# Altium project PCM1794.PrjPcb
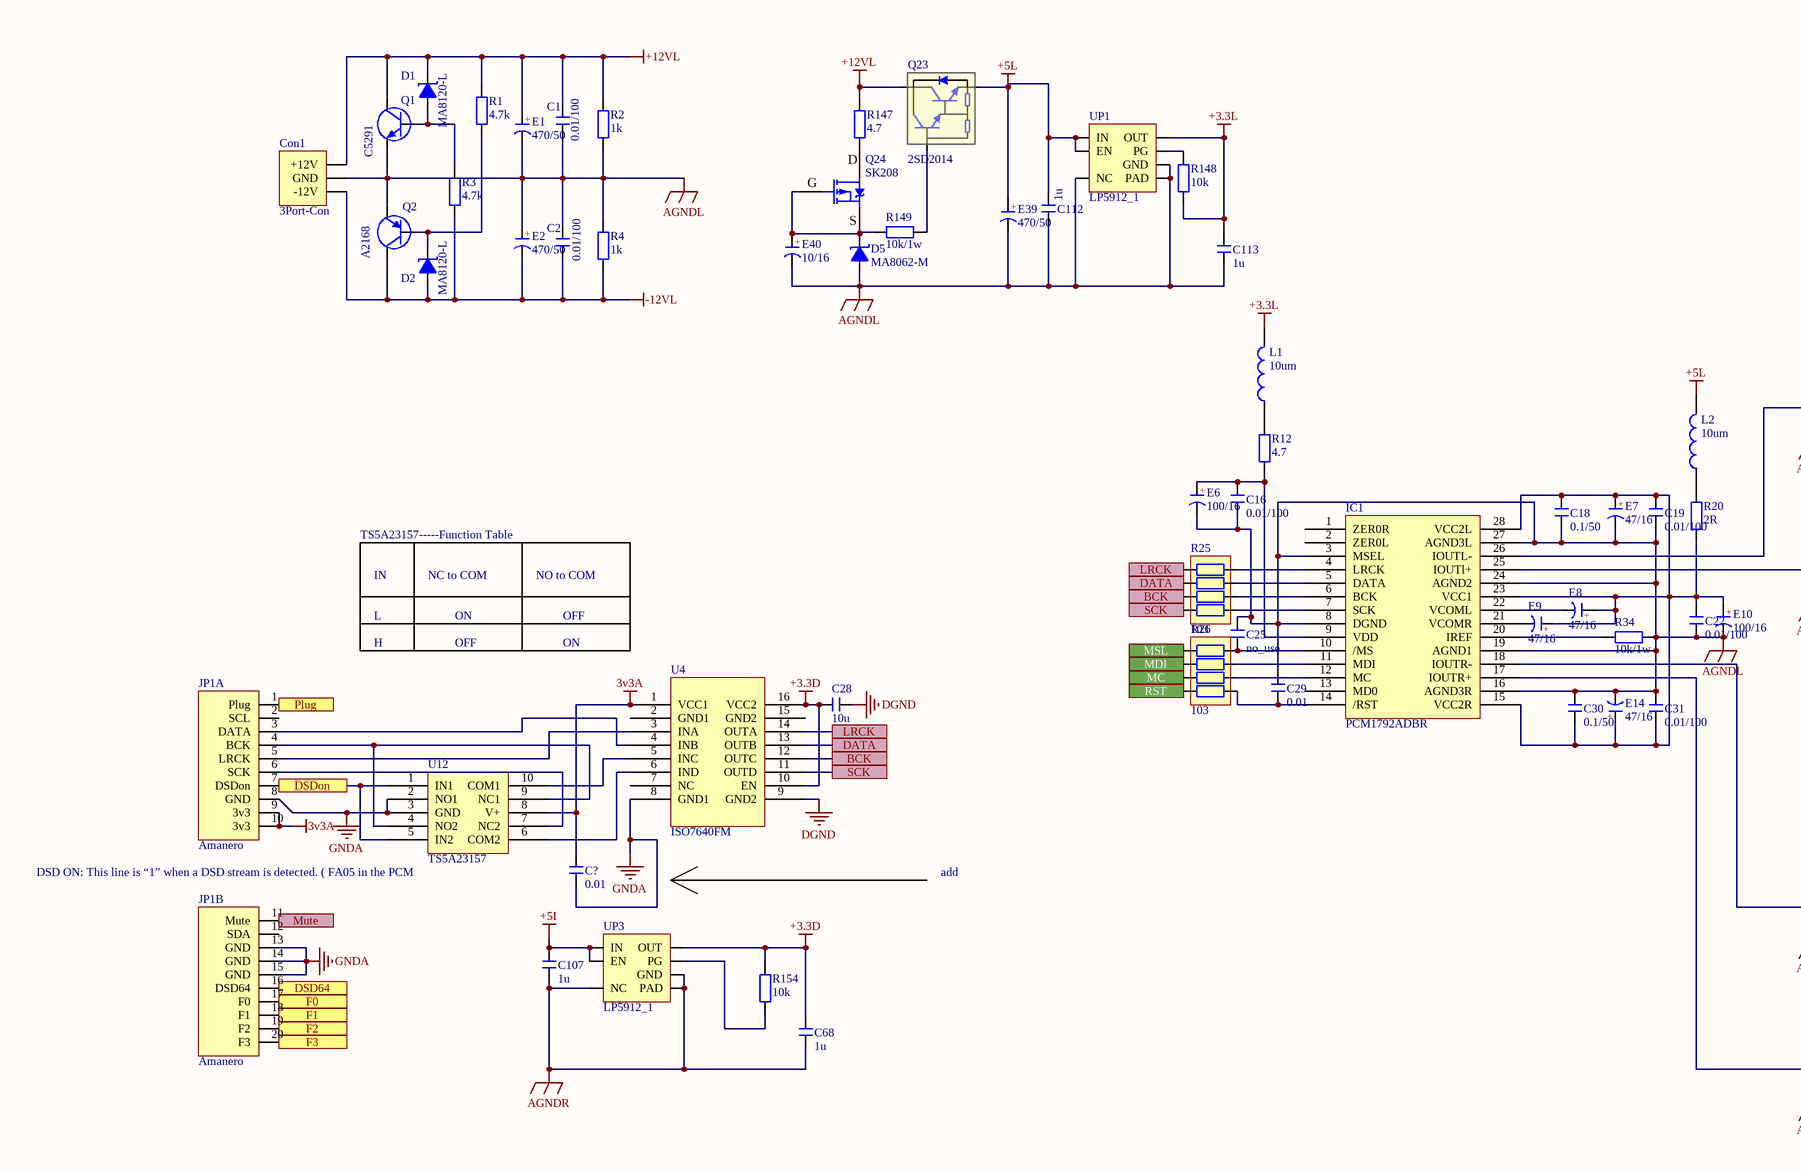
[diagram p0: Audio.SchDoc, top left]
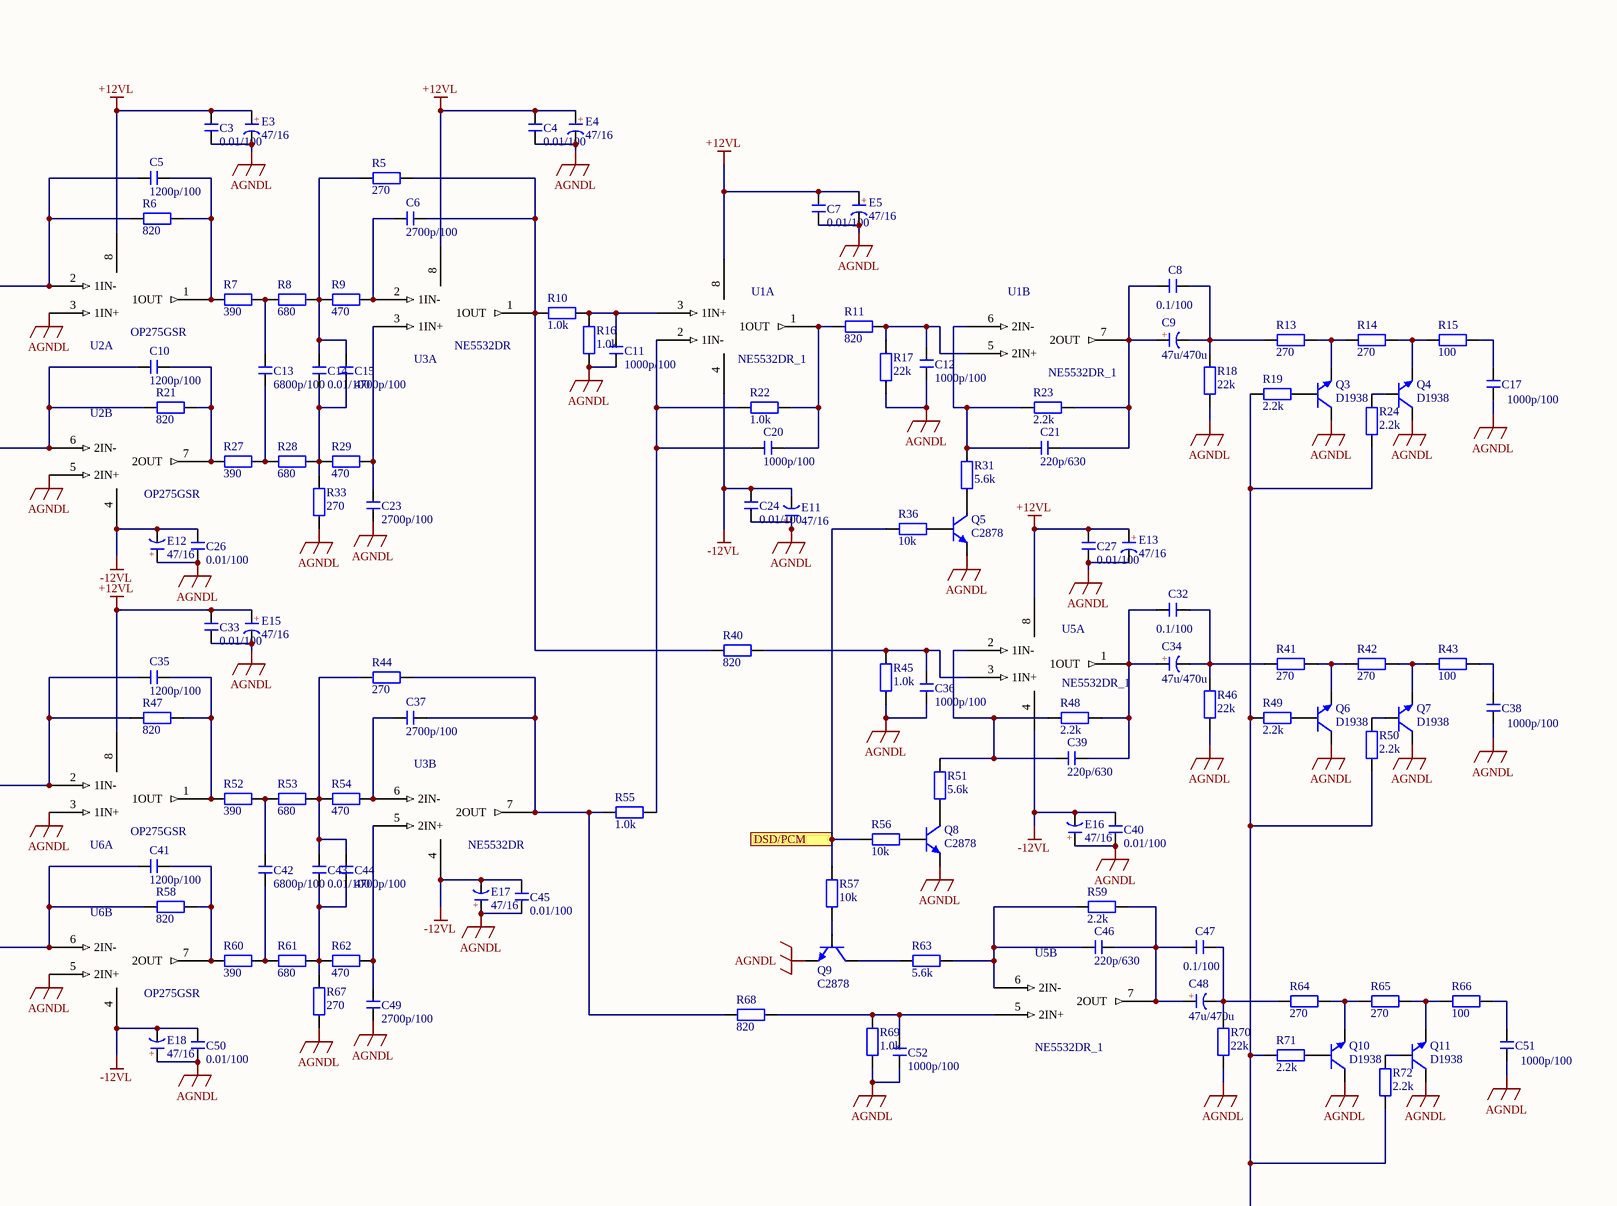
[diagram p1: Audio.SchDoc, top right]
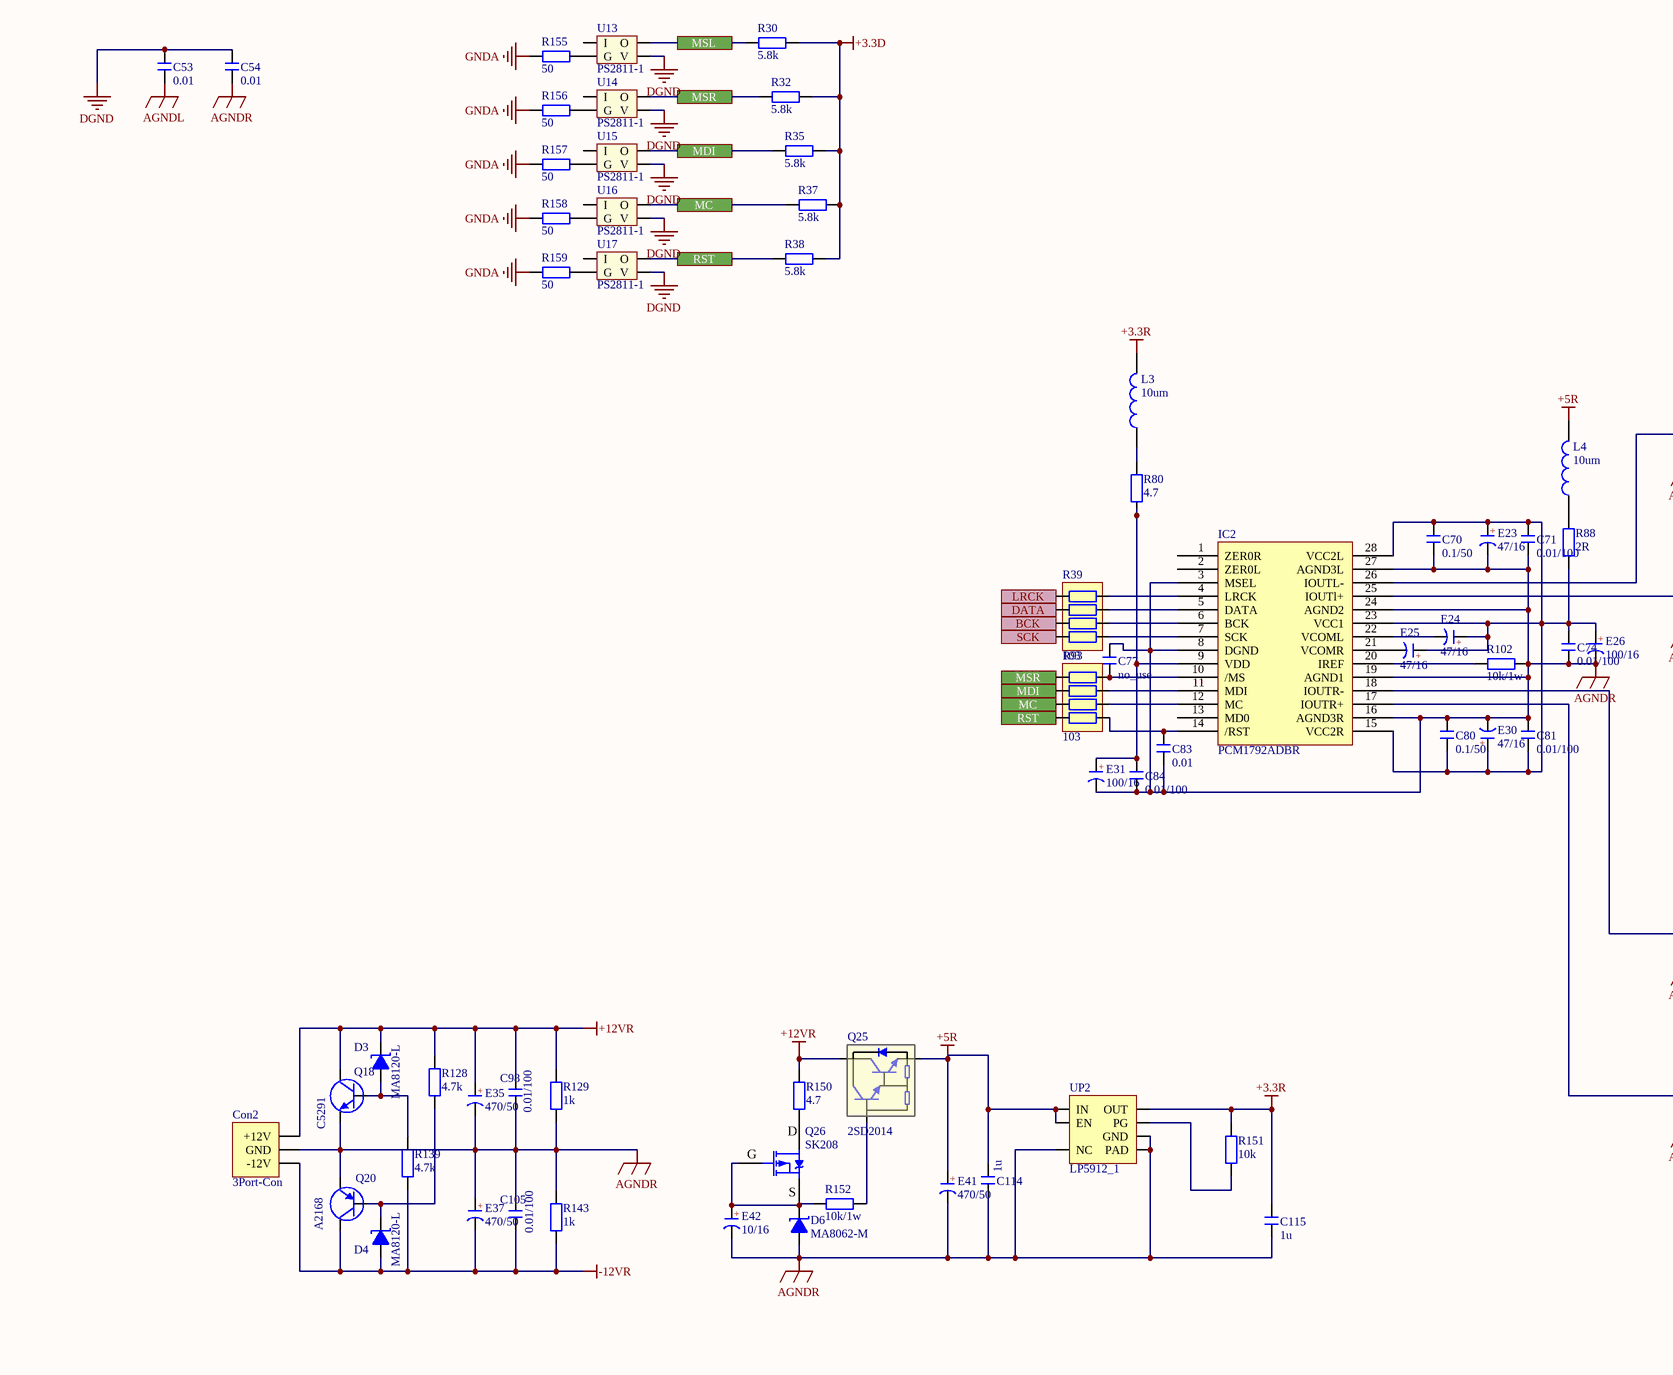
[diagram p2: Audio.SchDoc, bottom left]
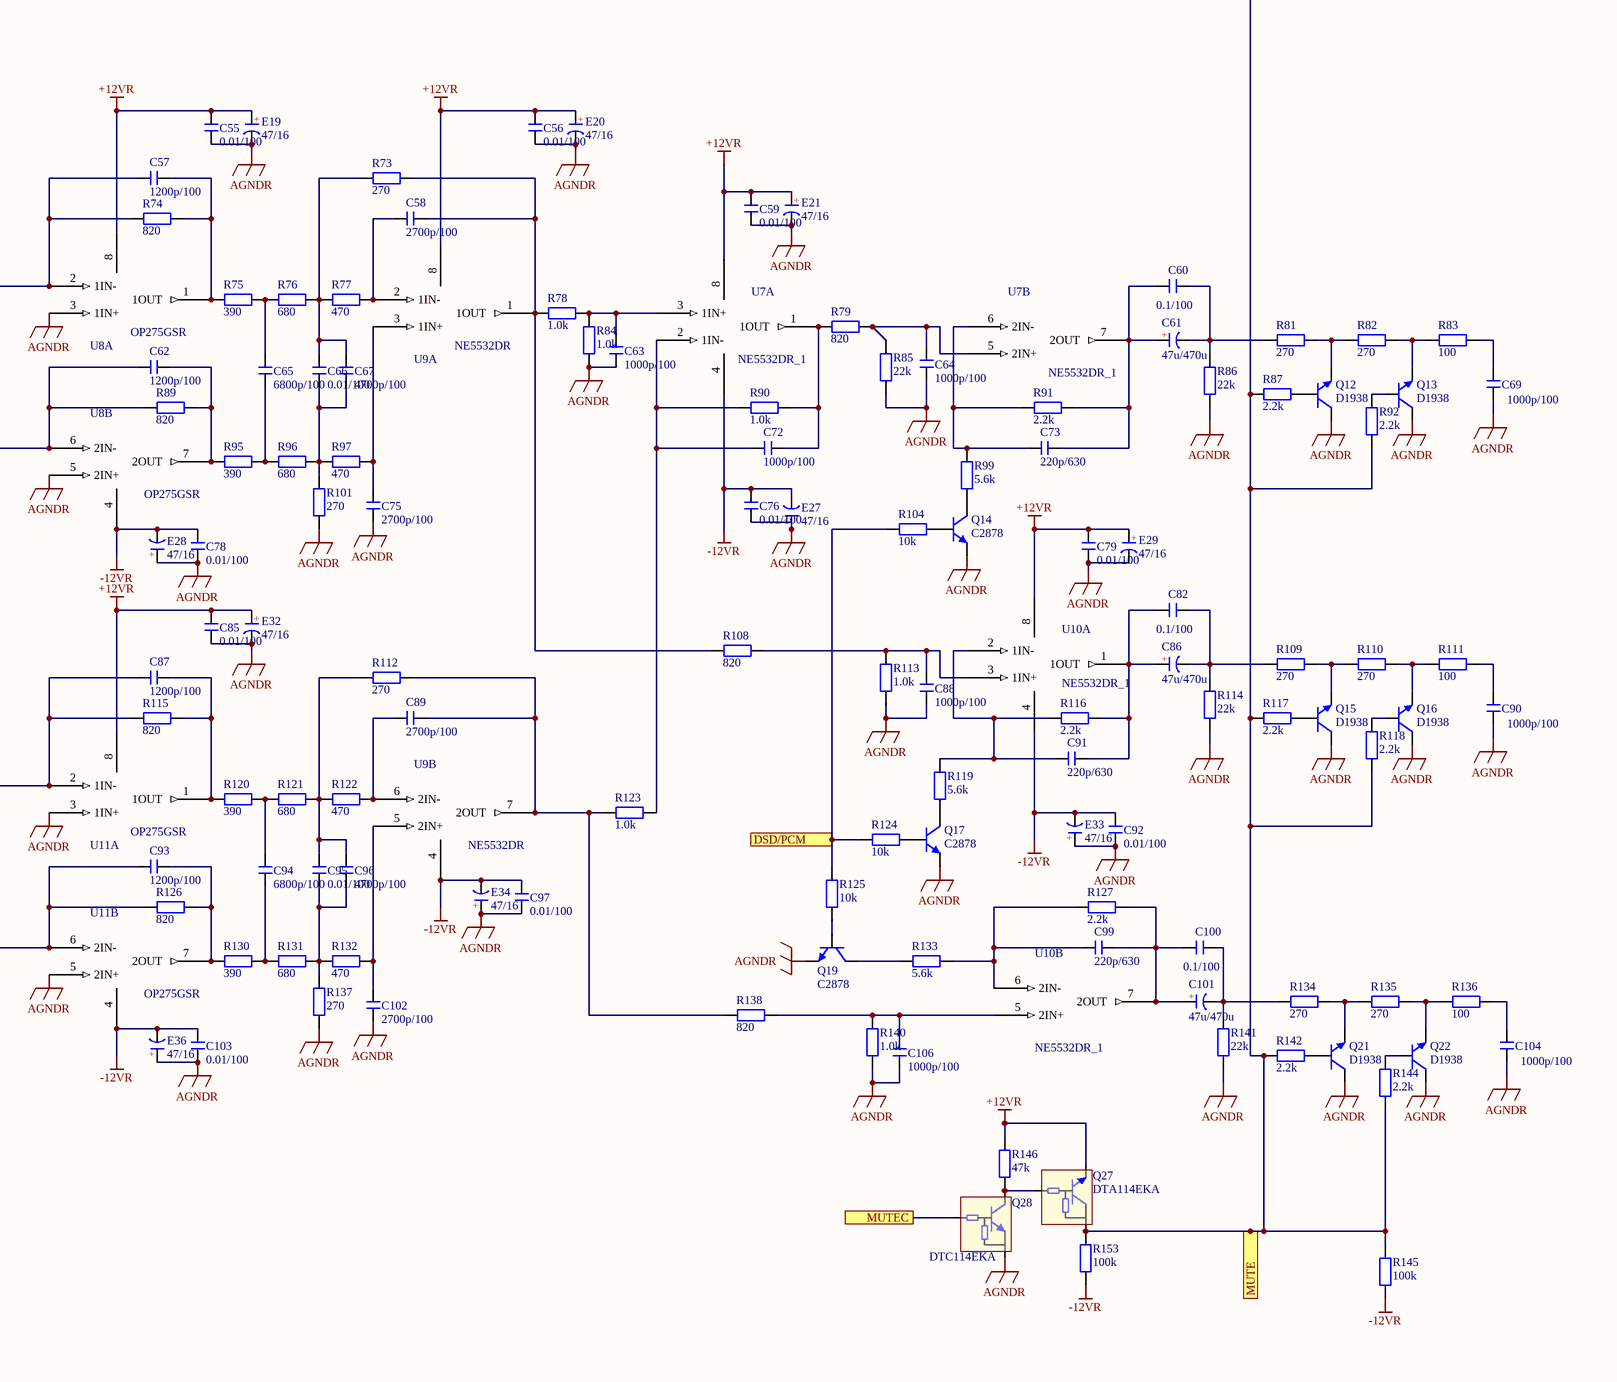
[diagram p3: Audio.SchDoc, bottom right]
1 sheet, 367 parts. Net scope: flat (ports and power ports of the same name join across sheets).
Board file: PCB_Audio.PcbDoc

## Sheet Audio.SchDoc
size A1

### Parts
C1  0.01/100  [CCB_Cap_5mm]
C2  0.01/100  [CCB_Cap_5mm]
C3  0.01/100
C4  0.01/100
C5  1200p/100
C6  2700p/100
C7  0.01/100
C8  0.1/100
C9  47u/470u
C10  1200p/100
C11  1000p/100
C12  1000p/100
C13  6800p/100
C14  0.01/100
C15  4700p/100
C16  0.01/100  [CCB_Cap_5mm_MIR]
C17  1000p/100
C18  0.1/50  [C0805]
C19  0.01/100
C20  1000p/100
C21  220p/630
C22  0.01/100
C23  2700p/100
C24  0.01/100
C25  no_use
C26  0.01/100
C27  0.01/100
C28  10u  [C0805]
C29  0.01  [C0805]
C30  0.1/50  [C0805]
C31  0.01/100
C32  0.1/100
C33  0.01/100
C34  47u/470u
C35  1200p/100
C36  1000p/100
C37  2700p/100
C38  1000p/100
C39  220p/630
C40  0.01/100
C41  1200p/100
C42  6800p/100
C43  0.01/100
C44  4700p/100
C45  0.01/100
C46  220p/630
C47  0.1/100
C48  47u/470u
C49  2700p/100
C50  0.01/100
C51  1000p/100
C52  1000p/100
C53  0.01  [C0805]
C54  0.01  [C0805]
C55  0.01/100
C56  0.01/100
C57  1200p/100
C58  2700p/100
C59  0.01/100
C60  0.1/100
C61  47u/470u
C62  1200p/100
C63  1000p/100
C64  1000p/100
C65  6800p/100
C66  0.01/100
C67  4700p/100
C68  1u  [C0805]
C69  1000p/100
C70  0.1/50  [C0805]
C71  0.01/100
C72  1000p/100
C73  220p/630
C74  0.01/100
C75  2700p/100
C76  0.01/100
C77  no_use
C78  0.01/100
C79  0.01/100
C80  0.1/50  [C0805]
C81  0.01/100
C82  0.1/100
C83  0.01  [C0805]
C84  0.01/100  [CCB_Cap_5mm]
C85  0.01/100
C86  47u/470u
C87  1200p/100
C88  1000p/100
C89  2700p/100
C90  1000p/100
C91  220p/630
C92  0.01/100
C93  1200p/100
C94  6800p/100
C95  0.01/100
C96  4700p/100
C97  0.01/100
C98  0.01/100  [CCB_Cap_5mm]
C99  220p/630
C100  0.1/100
C101  47u/470u
C102  2700p/100
C103  0.01/100
C104  1000p/100
C105  0.01/100  [CCB_Cap_5mm]
C106  1000p/100
C107  1u  [C0805]
C112  1u  [CCB_Cap_5mm_MIR]
C113  1u  [C0805]
C114  1u  [CCB_Cap_5mm_MIR]
C115  1u  [C0805]
C?  0.01  [C0805]
Con1  3Port-Con  [XH2.54-3P]
Con2  3Port-Con  [XH2.54-3P]
D1  MA8120-L  [SOD-323]
D2  MA8120-L  [SOD-323]
D3  MA8120-L  [SOD-323]
D4  MA8120-L  [SOD-323]
D5  MA8062-M  [SOD-323]
D6  MA8062-M  [SOD-323]
E1  470/50  [Cap-P]
E2  470/50  [Cap-P]
E3  47/16
E4  47/16
E5  47/16
E6  100/16  [cap-mir]
E7  47/16
E8  47/16
E9  47/16
E10  100/16
E11  47/16
E12  47/16
E13  47/16
E14  47/16
E15  47/16
E16  47/16
E17  47/16
E18  47/16
E19  47/16
E20  47/16
E21  47/16
E23  47/16
E24  47/16
E25  47/16
E26  100/16
E27  47/16
E28  47/16
E29  47/16
E30  47/16
E31  100/16  [cap]
E32  47/16
E33  47/16
E34  47/16
E35  470/50  [Cap-P]
E36  47/16
E37  470/50  [Cap-P]
E39  470/50  [Cap-P]
E40  10/16  [cap-mir]
E41  470/50  [Cap-P]
E42  10/16  [cap-mir]
IC1  PCM1792ADBR  [DB0028A_N]
IC2  PCM1792ADBR  [DB0028A_N]
JP1  Amanero  [HDR-9X2]  (parts A,B of 2)
L1  10um  [L 0805]
L2  10um  [L 0805]
L3  10um  [L 0805]
L4  10um  [L 0805]
Q1  C5291
Q2  A2168
Q3  D1938  [SOT23-3L]
Q4  D1938  [SOT23-3L]
Q5  C2878
Q6  D1938  [SOT23-3L]
Q7  D1938  [SOT23-3L]
Q8  C2878
Q9  C2878
Q10  D1938  [SOT23-3L]
Q11  D1938  [SOT23-3L]
Q12  D1938  [SOT23-3L]
Q13  D1938  [SOT23-3L]
Q14  C2878
Q15  D1938  [SOT23-3L]
Q16  D1938  [SOT23-3L]
Q17  C2878
Q18  C5291
Q19  C2878
Q20  A2168
Q21  D1938  [SOT23-3L]
Q22  D1938  [SOT23-3L]
Q23  2SD2014
Q24  SK208  [SOT23-3L]
Q25  2SD2014
Q26  SK208  [SOT23-3L]
Q27  DTA114EKA  [SOT23-3L]
Q28  DTC114EKA  [SOT23-3L]
R1  4.7k  [R 0805]
R2  1k  [Res_axial-Mir]
R3  4.7k  [R 0805]
R4  1k  [Res_axial-Mir]
R5  270
R6  820
R7  390
R8  680
R9  470
R10  1.0k
R11  820
R12  4.7
R13  270
R14  270
R15  100
R16  1.0k
R17  22k
R18  22k
R19  2.2k  [R 0805]
R20  2R
R21  820
R22  1.0k
R23  2.2k
R24  2.2k  [R 0805]
R25  103  [RCA-8P4R-0603]
R26  103  [RCA-8P4R-0603]
R27  390
R28  680
R29  470
R30  5.8k  [R 0805]
R31  5.6k
R32  5.8k  [R 0805]
R33  270
R34  10k/1w
R35  5.8k  [R 0805]
R36  10k  [R 0805]
R37  5.8k  [R 0805]
R38  5.8k  [R 0805]
R39  103  [RCA-8P4R-0603]
R40  820
R41  270
R42  270
R43  100
R44  270
R45  1.0k
R46  22k
R47  820
R48  2.2k
R49  2.2k  [R 0805]
R50  2.2k  [R 0805]
R51  5.6k
R52  390
R53  680
R54  470
R55  1.0k
R56  10k  [R 0805]
R57  10k  [R 0805]
R58  820
R59  2.2k
R60  390
R61  680
R62  470
R63  5.6k
R64  270
R65  270
R66  100
R67  270
R68  820
R69  1.0k
R70  22k
R71  2.2k  [R 0805]
R72  2.2k  [R 0805]
R73  270
R74  820
R75  390
R76  680
R77  470
R78  1.0k
R79  820
R80  4.7
R81  270
R82  270
R83  100
R84  1.0k
R85  22k
R86  22k
R87  2.2k  [R 0805]
R88  2R
R89  820
R90  1.0k
R91  2.2k
R92  2.2k  [R 0805]
R93  103  [RCA-8P4R-0603]
R95  390
R96  680
R97  470
R99  5.6k
R101  270
R102  10k/1w
R104  10k  [R 0805]
R108  820
R109  270
R110  270
R111  100
R112  270
R113  1.0k
R114  22k
R115  820
R116  2.2k
R117  2.2k  [R 0805]
R118  2.2k  [R 0805]
R119  5.6k
R120  390
R121  680
R122  470
R123  1.0k
R124  10k  [R 0805]
R125  10k  [R 0805]
R126  820
R127  2.2k
R128  4.7k  [R 0805]
R129  1k  [Res_axial-Mir]
R130  390
R131  680
R132  470
R133  5.6k
R134  270
R135  270
R136  100
R137  270
R138  820
R139  4.7k  [R 0805]
R140  1.0k
R141  22k
R142  2.2k  [R 0805]
R143  1k  [Res_axial-Mir]
R144  2.2k  [R 0805]
R145  100k
R146  47k  [R 0805]
R147  4.7  [Res_axial-Mir]
R148  10k  [R 0805]
R149  10k/1w  [Res_axial-Mir]
R150  4.7  [Res_axial-Mir]
R151  10k  [R 0805]
R152  10k/1w  [Res_axial-Mir]
R153  100k  [R 0805]
R154  10k  [R 0805]
R155  50  [R 0603]
R156  50  [R 0603]
R157  50  [R 0603]
R158  50  [R 0603]
R159  50  [R 0603]
U1  NE5532DR_1  [D8]  (parts A,B of 2)
U2  OP275GSR  [D8]  (parts A,B of 2)
U3  NE5532DR  [D8]  (parts A,B of 2)
U4  ISO7640FM  [SOIC16]
U5  NE5532DR_1  [D8]  (parts A,B of 2)
U6  OP275GSR  [D8]  (parts A,B of 2)
U7  NE5532DR_1  [D8]  (parts A,B of 2)
U8  OP275GSR  [D8]  (parts A,B of 2)
U9  NE5532DR  [D8]  (parts A,B of 2)
U10  NE5532DR_1  [D8]  (parts A,B of 2)
U11  OP275GSR  [D8]  (parts A,B of 2)
U12  TS5A23157  [DGS-10]
U13  PS2811-1  [SSOP4_N]
U14  PS2811-1  [SSOP4_N]
U15  PS2811-1  [SSOP4_N]
U16  PS2811-1  [SSOP4_N]
U17  PS2811-1  [SSOP4_N]
UP1  LP5912_1  [WSON]
UP2  LP5912_1  [WSON]
UP3  LP5912_1  [WSON]

### Ports
BCK, DATA, DSD64, DSD/PCM, DSDon, F0, F1, F2, F3, LRCK, MC, MDI, MSL, MSR, MUTE, Mute, MUTEC, Plug, RST, SCK

### Nets
3v3A: C?.1 JP1.9(3v3) JP1.10(3v3) U4.1(VCC1) U12.8(V+)
+3.3D: C28.1 C68.1 R30.2 R32.2 R35.2 R37.2 R38.2 R154.2 U4.10(EN) U4.16(VCC2) UP3.1(OUT)
+3.3L: C113.1 L1.2 R148.1 UP1.1(OUT)
+3.3R: C115.1 L3.2 R151.2 UP2.1(OUT)
+5I: C107.1 UP3.4(EN) UP3.6(IN)
+5L: C112.1 E39.K L2.2 Q23.3(E) UP1.4(EN) UP1.6(IN)
+5R: C114.1 E41.K L4.2 Q25.3(E) UP2.4(EN) UP2.6(IN)
+12VL: C1.1 C3.1 C4.1 C7.1 C27.1 C33.1 Con1.1(+12V) D1.2(K) E1.K E3.K E4.K E5.K E13.K E15.K Q1.2(C) Q23.2(C) R1.2 R2.2 R147.2 U1.8(VCC+) U2.8(VCC+) U3.8(VCC+) U5.8(VCC+) U6.8(VCC+)
+12VR: C55.1 C56.1 C59.1 C79.1 C85.1 C98.1 Con2.1(+12V) D3.2(K) E19.K E20.K E21.K E29.K E32.K E35.K Q18.2(C) Q25.2(C) Q27.2(E) R128.2 R129.2 R146.2 R150.2 U7.8(VCC+) U8.8(VCC+) U9.8(VCC+) U10.8(VCC+) U11.8(VCC+)
-12VL: C2.2 C24.1 C26.1 C40.1 C45.1 C50.1 Con1.3(-12V) D2.1(A) E2.A E11.A E12.A E16.A E17.A E18.A Q2.2(C) R3.1 R4.1 U1.4(VCC-) U2.4(VCC-) U3.4(VCC-) U5.4(VCC-) U6.4(VCC-)
-12VR: C76.1 C78.1 C92.1 C97.1 C103.1 C105.2 Con2.3(-12V) D4.1(A) E27.A E28.A E33.A E34.A E36.A E37.A Q20.2(C) R139.1 R143.1 R145.1 R153.1 U7.4(VCC-) U8.4(VCC-) U9.4(VCC-) U10.4(VCC-) U11.4(VCC-)
AGNDL: C1.2 C2.1 C3.2 C4.2 C7.2 C11.2 C12.2 C16.2 C17.2 C18.2 C19.2 C22.2 C23.2 C24.2 C25.1 C26.2 C27.2 C29.1 C30.2 C31.2 C33.2 C36.2 C38.2 C40.2 C45.2 C49.2 C50.2 C51.2 C52.2 C53.2 C112.2 C113.2 Con1.2(GND) D5.1(A) E1.A E2.K E3.A E4.A E5.A E6.A E7.A E10.A E11.K E12.K E13.A E14.A E15.A E16.K E17.K E18.K E39.A E40.A IC1.3(MSEL) IC1.8(DGND) IC1.16(AGND3R) IC1.19(AGND1) IC1.24(AGND2) IC1.27(AGND3L) Q1.1(E) Q2.1(E) Q3.3(C) Q4.3(C) Q5.2(E) Q6.3(C) Q7.3(C) Q8.2(E) Q9.2(E) Q10.3(C) Q11.3(C) R2.1 R4.2 R16.1 R17.1 R18.1 R33.1 R34.2 R45.1 R46.1 R67.1 R69.1 R70.1 U2.3(1IN+) U2.5(2IN+) U6.3(1IN+) U6.5(2IN+) UP1.2(NC) UP1.5(GND) UP1.7(PAD)
AGNDR: C54.2 C55.2 C56.2 C59.2 C63.2 C64.2 C68.2 C69.2 C70.2 C71.2 C74.2 C75.2 C76.2 C77.1 C78.2 C79.2 C80.2 C81.2 C83.2 C84.2 C85.2 C88.2 C90.2 C92.2 C97.2 C98.2 C102.2 C103.2 C104.2 C105.1 C106.2 C107.2 C114.2 C115.2 Con2.2(GND) D6.1(A) E19.A E20.A E21.A E23.A E26.A E27.K E28.K E29.A E30.A E31.A E32.A E33.K E34.K E35.A E36.K E37.K E41.A E42.A IC2.3(MSEL) IC2.8(DGND) IC2.16(AGND3R) IC2.19(AGND1) IC2.24(AGND2) IC2.27(AGND3L) Q12.3(C) Q13.3(C) Q14.2(E) Q15.3(C) Q16.3(C) Q17.2(E) Q18.1(E) Q19.2(E) Q20.1(E) Q21.3(C) Q22.3(C) Q28.2(C) R84.1 R85.1 R86.1 R101.1 R102.2 R113.1 R114.1 R129.1 R137.1 R140.1 R141.1 R143.2 U8.3(1IN+) U8.5(2IN+) U11.3(1IN+) U11.5(2IN+) UP2.2(NC) UP2.5(GND) UP2.7(PAD) UP3.2(NC) UP3.5(GND) UP3.7(PAD)
DGND: C28.2 C53.1 C54.1 U4.9(GND2) U13.3(V) U14.3(V) U15.3(V) U16.3(V) U17.3(V)
GNDA: C?.2 JP1.8(GND) JP1.13(GND) JP1.14(GND) JP1.15(GND) R155.1 R156.1 R157.1 R158.1 R159.1 U4.8(GND1) U12.2(NO1) U12.3(GND)
NetC5_1: C5.1 R6.2 R7.1 U2.1(1OUT)
NetC5_2: C5.2 IC1.26(IOUTL-) R6.1 U2.2(1IN-)
NetC6_1: C6.1 R9.2 U3.2(1IN-)
NetC6_2: C6.2 R5.2 R10.1 R40.1 U3.1(1OUT)
NetC8_1: C8.1 C9.K C21.2 R23.2 U1.7(2OUT)
NetC8_2: C8.2 C9.A R13.1 R18.2
NetC10_1: C10.1 IC1.25(IOUTl+) R21.1 U2.6(2IN-)
NetC10_2: C10.2 R21.2 R27.1 U2.7(2OUT)
NetC11_1: C11.1 R10.2 R16.2 U1.3(1IN+)
NetC12_1: C12.1 R11.2 R17.2 U1.5(2IN+)
NetC13_1: C13.1 R7.2 R8.1
NetC13_2: C13.2 R27.2 R28.1
NetC14_1: C14.1 C15.1 R5.1 R8.2 R9.1
NetC14_2: C14.2 C15.2 R28.2 R29.1 R33.2
NetC16_1: C16.1 E6.K IC1.9(VDD) R12.1
NetC17_1: C17.1 R15.2
NetC18_1: C18.1 C19.1 C22.1 C30.1 C31.1 E7.K E8.K E9.K E10.K E14.K IC1.15(VCC2R) IC1.23(VCC1) IC1.28(VCC2L) R20.1
NetC20_1: C20.1 R22.1 R55.2 U1.2(1IN-)
NetC20_2: C20.2 R11.1 R22.2 U1.1(1OUT)
NetC21_1: C21.1 R23.1 R31.2 U1.6(2IN-)
NetC23_1: C23.1 R29.2 U3.3(1IN+)
NetC25_2: C25.2 IC1.10(/MS) R26.8
NetC29_2: C29.2 IC1.14(/RST) R26.5
NetC32_1: C32.1 C34.K C39.2 R48.2 U5.1(1OUT)
NetC32_2: C32.2 C34.A R41.1 R46.2
NetC35_1: C35.1 R47.2 R52.1 U6.1(1OUT)
NetC35_2: C35.2 IC1.18(IOUTR-) R47.1 U6.2(1IN-)
NetC36_1: C36.1 R40.2 R45.2 U5.3(1IN+)
NetC37_1: C37.1 R54.2 U3.6(2IN-)
NetC37_2: C37.2 R44.2 R55.1 R68.1 U3.7(2OUT)
NetC38_1: C38.1 R43.2
NetC39_1: C39.1 R48.1 R51.2 U5.2(1IN-)
NetC41_1: C41.1 IC1.17(IOUTR+) R58.1 U6.6(2IN-)
NetC41_2: C41.2 R58.2 R60.1 U6.7(2OUT)
NetC42_1: C42.1 R52.2 R53.1
NetC42_2: C42.2 R60.2 R61.1
NetC43_1: C43.1 C44.1 R44.1 R53.2 R54.1
NetC43_2: C43.2 C44.2 R61.2 R62.1 R67.2
NetC46_1: C46.1 R59.1 R63.2 U5.6(2IN-)
NetC46_2: C46.2 C47.1 C48.K R59.2 U5.7(2OUT)
NetC47_2: C47.2 C48.A R64.1 R70.2
NetC49_1: C49.1 R62.2 U3.5(2IN+)
NetC51_1: C51.1 R66.2
NetC52_1: C52.1 R68.2 R69.2 U5.5(2IN+)
NetC57_1: C57.1 R74.2 R75.1 U8.1(1OUT)
NetC57_2: C57.2 IC2.26(IOUTL-) R74.1 U8.2(1IN-)
NetC58_1: C58.1 R77.2 U9.2(1IN-)
NetC58_2: C58.2 R73.2 R78.1 R108.1 U9.1(1OUT)
NetC60_1: C60.1 C61.K C73.2 R91.2 U7.7(2OUT)
NetC60_2: C60.2 C61.A R81.1 R86.2
NetC62_1: C62.1 IC2.25(IOUTl+) R89.1 U8.6(2IN-)
NetC62_2: C62.2 R89.2 R95.1 U8.7(2OUT)
NetC63_1: C63.1 R78.2 R84.2 U7.3(1IN+)
NetC64_1: C64.1 R79.2 R85.2 U7.5(2IN+)
NetC65_1: C65.1 R75.2 R76.1
NetC65_2: C65.2 R95.2 R96.1
NetC66_1: C66.1 C67.1 R73.1 R76.2 R77.1
NetC66_2: C66.2 C67.2 R96.2 R97.1 R101.2
NetC69_1: C69.1 R83.2
NetC70_1: C70.1 C71.1 C74.1 C80.1 C81.1 E23.K E24.K E25.K E26.K E30.K IC2.15(VCC2R) IC2.23(VCC1) IC2.28(VCC2L) R88.1
NetC72_1: C72.1 R90.1 R123.2 U7.2(1IN-)
NetC72_2: C72.2 R79.1 R90.2 U7.1(1OUT)
NetC73_1: C73.1 R91.1 R99.2 U7.6(2IN-)
NetC75_1: C75.1 R97.2 U9.3(1IN+)
NetC77_2: C77.2 IC2.10(/MS) R93.8
NetC82_1: C82.1 C86.K C91.2 R116.2 U10.1(1OUT)
NetC82_2: C82.2 C86.A R109.1 R114.2
NetC83_1: C83.1 IC2.14(/RST) R93.5
NetC84_1: C84.1 E31.K IC2.9(VDD) R80.1
NetC87_1: C87.1 R115.2 R120.1 U11.1(1OUT)
NetC87_2: C87.2 IC2.18(IOUTR-) R115.1 U11.2(1IN-)
NetC88_1: C88.1 R108.2 R113.2 U10.3(1IN+)
NetC89_1: C89.1 R122.2 U9.6(2IN-)
NetC89_2: C89.2 R112.2 R123.1 R138.1 U9.7(2OUT)
NetC90_1: C90.1 R111.2
NetC91_1: C91.1 R116.1 R119.2 U10.2(1IN-)
NetC93_1: C93.1 IC2.17(IOUTR+) R126.1 U11.6(2IN-)
NetC93_2: C93.2 R126.2 R130.1 U11.7(2OUT)
NetC94_1: C94.1 R120.2 R121.1
NetC94_2: C94.2 R130.2 R131.1
NetC95_1: C95.1 C96.1 R112.1 R121.2 R122.1
NetC95_2: C95.2 C96.2 R131.2 R132.1 R137.2
NetC99_1: C99.1 R127.1 R133.2 U10.6(2IN-)
NetC99_2: C99.2 C100.1 C101.K R127.2 U10.7(2OUT)
NetC100_2: C100.2 C101.A R134.1 R141.2
NetC102_1: C102.1 R132.2 U9.5(2IN+)
NetC104_1: C104.1 R136.2
NetC106_1: C106.1 R138.2 R140.2 U10.5(2IN+)
NetD1_1: D1.1(A) Q1.3(B) R3.2
NetD2_2: D2.2(K) Q2.3(B) R1.1
NetD3_1: D3.1(A) Q18.3(B) R139.2
NetD4_2: D4.2(K) Q20.3(B) R128.1
NetD5_2: D5.2(K) E40.K Q24.1(G) Q24.3(S) R149.1
NetD6_2: D6.2(K) E42.K Q26.1(G) Q26.3(S) R152.1
NetE8_A: E8.A IC1.22(VCOML)
NetE9_A: E9.A IC1.21(VCOMR)
NetE24_A: E24.A IC2.22(VCOML)
NetE25_A: E25.A IC2.21(VCOMR)
NetIC1_4: IC1.4(LRCK) R25.8
NetIC1_5: IC1.5(DATA) R25.7
NetIC1_6: IC1.6(BCK) R25.6
NetIC1_7: IC1.7(SCK) R25.5
NetIC1_11: IC1.11(MDI) R26.7
NetIC1_12: IC1.12(MC) R26.6
NetIC1_20: IC1.20(IREF) R34.1
NetIC2_4: IC2.4(LRCK) R39.8
NetIC2_5: IC2.5(DATA) R39.7
NetIC2_6: IC2.6(BCK) R39.6
NetIC2_7: IC2.7(SCK) R39.5
NetIC2_11: IC2.11(MDI) R93.7
NetIC2_12: IC2.12(MC) R93.6
NetIC2_20: IC2.20(IREF) R102.1
NetJP1_1: JP1.1(Plug) ; port Plug
NetJP1_3: JP1.3(DATA) U4.4(INB)
NetJP1_4: JP1.4(BCK) U12.4(NO2) U12.9(NC1)
NetJP1_5: JP1.5(LRCK) U4.3(INA)
NetJP1_6: JP1.6(SCK) U12.7(NC2)
NetJP1_7: JP1.7(DSDon) U12.1(IN1) U12.5(IN2) ; port DSDon
NetJP1_11: JP1.11(Mute) Q27.3(C) R19.2 R24.1 R49.2 R50.1 R71.2 R72.1 R87.2 R92.1 R117.2 R118.1 R142.2 R144.1 R145.2 R153.2 ; port MUTE, port Mute
NetJP1_16: JP1.16(DSD64) ; port DSD64
NetJP1_17: JP1.17(F0) ; port F0
NetJP1_18: JP1.18(F1) ; port F1
NetJP1_19: JP1.19(F2) ; port F2
NetJP1_20: JP1.20(F3) ; port F3
NetL1_1: L1.1 R12.2
NetL2_1: L2.1 R20.2
NetL3_1: L3.1 R80.2
NetL4_1: L4.1 R88.2
NetQ3_1: Q3.1(B) R19.1
NetQ3_2: Q3.2(E) R13.2 R14.1
NetQ4_1: Q4.1(B) R24.2
NetQ4_2: Q4.2(E) R14.2 R15.1
NetQ5_1: Q5.1(B) R36.2
NetQ5_3: Q5.3(C) R31.1
NetQ6_1: Q6.1(B) R49.1
NetQ6_2: Q6.2(E) R41.2 R42.1
NetQ7_1: Q7.1(B) R50.2
NetQ7_2: Q7.2(E) R42.2 R43.1
NetQ8_1: Q8.1(B) R56.2
NetQ8_3: Q8.3(C) R51.1
NetQ9_1: Q9.1(B) R57.1
NetQ9_3: Q9.3(C) R63.1
NetQ10_1: Q10.1(B) R71.1
NetQ10_2: Q10.2(E) R64.2 R65.1
NetQ11_1: Q11.1(B) R72.2
NetQ11_2: Q11.2(E) R65.2 R66.1
NetQ12_1: Q12.1(B) R87.1
NetQ12_2: Q12.2(E) R81.2 R82.1
NetQ13_1: Q13.1(B) R92.2
NetQ13_2: Q13.2(E) R82.2 R83.1
NetQ14_1: Q14.1(B) R104.2
NetQ14_3: Q14.3(C) R99.1
NetQ15_1: Q15.1(B) R117.1
NetQ15_2: Q15.2(E) R109.2 R110.1
NetQ16_1: Q16.1(B) R118.2
NetQ16_2: Q16.2(E) R110.2 R111.1
NetQ17_1: Q17.1(B) R124.2
NetQ17_3: Q17.3(C) R119.1
NetQ19_1: Q19.1(B) R125.1
NetQ19_3: Q19.3(C) R133.1
NetQ21_1: Q21.1(B) R142.1
NetQ21_2: Q21.2(E) R134.2 R135.1
NetQ22_1: Q22.1(B) R144.2
NetQ22_2: Q22.2(E) R135.2 R136.1
NetQ23_1: Q23.1(B) R149.2
NetQ24_2: Q24.2(D) R147.1
NetQ25_1: Q25.1(B) R152.2
NetQ26_2: Q26.2(D) R150.1
NetQ27_1: Q27.1(B) Q28.3(E) R146.1
NetQ28_1: Q28.1(B) ; port MUTEC
NetR25_1: R25.1 R39.1 U4.14(OUTA) ; port LRCK
NetR25_2: R25.2 R39.2 U4.13(OUTB) ; port DATA
NetR25_3: R25.3 R39.3 U4.12(OUTC) ; port BCK
NetR25_4: R25.4 R39.4 U4.11(OUTD) ; port SCK
NetR26_1: R26.1 R30.1 U13.4(O) ; port MSL
NetR26_2: R26.2 R35.1 R93.2 U15.4(O) ; port MDI
NetR26_3: R26.3 R37.1 R93.3 U16.4(O) ; port MC
NetR26_4: R26.4 R38.1 R93.4 U17.4(O) ; port RST
NetR32_1: R32.1 R93.1 U14.4(O) ; port MSR
NetR36_1: R36.1 R56.1 R57.2 R104.1 R124.1 R125.2 ; port DSD/PCM
NetR148_2: R148.2 UP1.3(PG)
NetR151_1: R151.1 UP2.3(PG)
NetR154_1: R154.1 UP3.3(PG)
NetR155_2: R155.2 U13.2(G)
NetR156_2: R156.2 U14.2(G)
NetR157_2: R157.2 U15.2(G)
NetR158_2: R158.2 U16.2(G)
NetR159_2: R159.2 U17.2(G)
NetU4_5: U4.5(INC) U12.10(COM1)
NetU4_6: U4.6(IND) U12.6(COM2)

Not connected (* = marked no-connect by the designer): IC1 1(ZER0R) 2(ZER0L) 13(MD0); IC2 1(ZER0R) 2(ZER0L) 13(MD0); JP1 2(SCL) 12(SDA); U4 2(GND1) 7(NC) 15(GND2); U13 1(I); U14 1(I); U15 1(I); U16 1(I); U17 1(I)

### Notes on the sheet
- TS5A23157-----Function Table
- IN
- L
- NC to COM
- ON
- NO to COM
- OFF
- H
- DSD ON: This line is “1” when a DSD stream is detected. ( FA05 in the PCM
- add
- (in symbol CS) +

### Library data of the parts
C1-C8 C10-C33 C35-C47 C49-C60 C62-C85 C87-C100 C102-C107 C112-C115 C? = CC: 陶片电容
C9 C34 C48 C61 C86 C101 E1-E21 E23-E37 E39-E42 = CS: 电解电容
Con1 Con2 = 3Port-Con: Dual-12V Connector
JP1 = Amanero: Manufacturer: Texas Instruments; GENERIC_PART_NUMBER: NE5532; INDUSTRY_STD_PKG_TYPE: SOIC; FAMILY_NAME: STANDARD LINEAR AMPLIFIER; PIN_COUNT: 8; PACKAGE_DESIGNATOR: D; Datasheet_URL: http://www.ti.com/lit/gpn/NE5532; Value: Value; Type: Type; RefDes: RefDes
L1-L4 = L: 小功率贴片电感; 版权归属: 源创客; BOM名称: 小功率贴片电感; 学习资源: www.ooocke.com
R1-R24 R27-R38 R40-R92 R95-R97 R99 R101 R102 R104 R108-R159 = Res
R25 R26 R39 R93 = R-8P4R: 贴片网络排阻; 版权归属: 源创客; BOM名称: 贴片网络排阻; 学习资源: www.ooocke.com
U1 U5 U7 U10 = NE5532DR_1: Imported; Manufacturer: Texas Instruments; GENERIC_PART_NUMBER: NE5532; INDUSTRY_STD_PKG_TYPE: SOIC; FAMILY_NAME: STANDARD LINEAR AMPLIFIER; PIN_COUNT: 8; PACKAGE_DESIGNATOR: D; Datasheet_URL: http://www.ti.com/lit/gpn/NE5532; Value: Value; Type: Type; RefDes: RefDes
U2 U6 U8 U11 = OP275GSR: Imported; Manufacturer: Texas Instruments; GENERIC_PART_NUMBER: NE5532; INDUSTRY_STD_PKG_TYPE: SOIC; FAMILY_NAME: STANDARD LINEAR AMPLIFIER; PIN_COUNT: 8; PACKAGE_DESIGNATOR: D; Datasheet_URL: http://www.ti.com/lit/gpn/NE5532; Value: Value; Type: Type; RefDes: RefDes
U3 U9 = NE5532DR: Imported; Manufacturer: Texas Instruments; GENERIC_PART_NUMBER: NE5532; INDUSTRY_STD_PKG_TYPE: SOIC; FAMILY_NAME: STANDARD LINEAR AMPLIFIER; PIN_COUNT: 8; PACKAGE_DESIGNATOR: D; Datasheet_URL: http://www.ti.com/lit/gpn/NE5532; Value: Value; Type: Type; RefDes: RefDes
U12 = TS5A23157: SPDT